# EAGLE design Air Monitor for Home Assistant V1.1 (EAGLE 6.1)
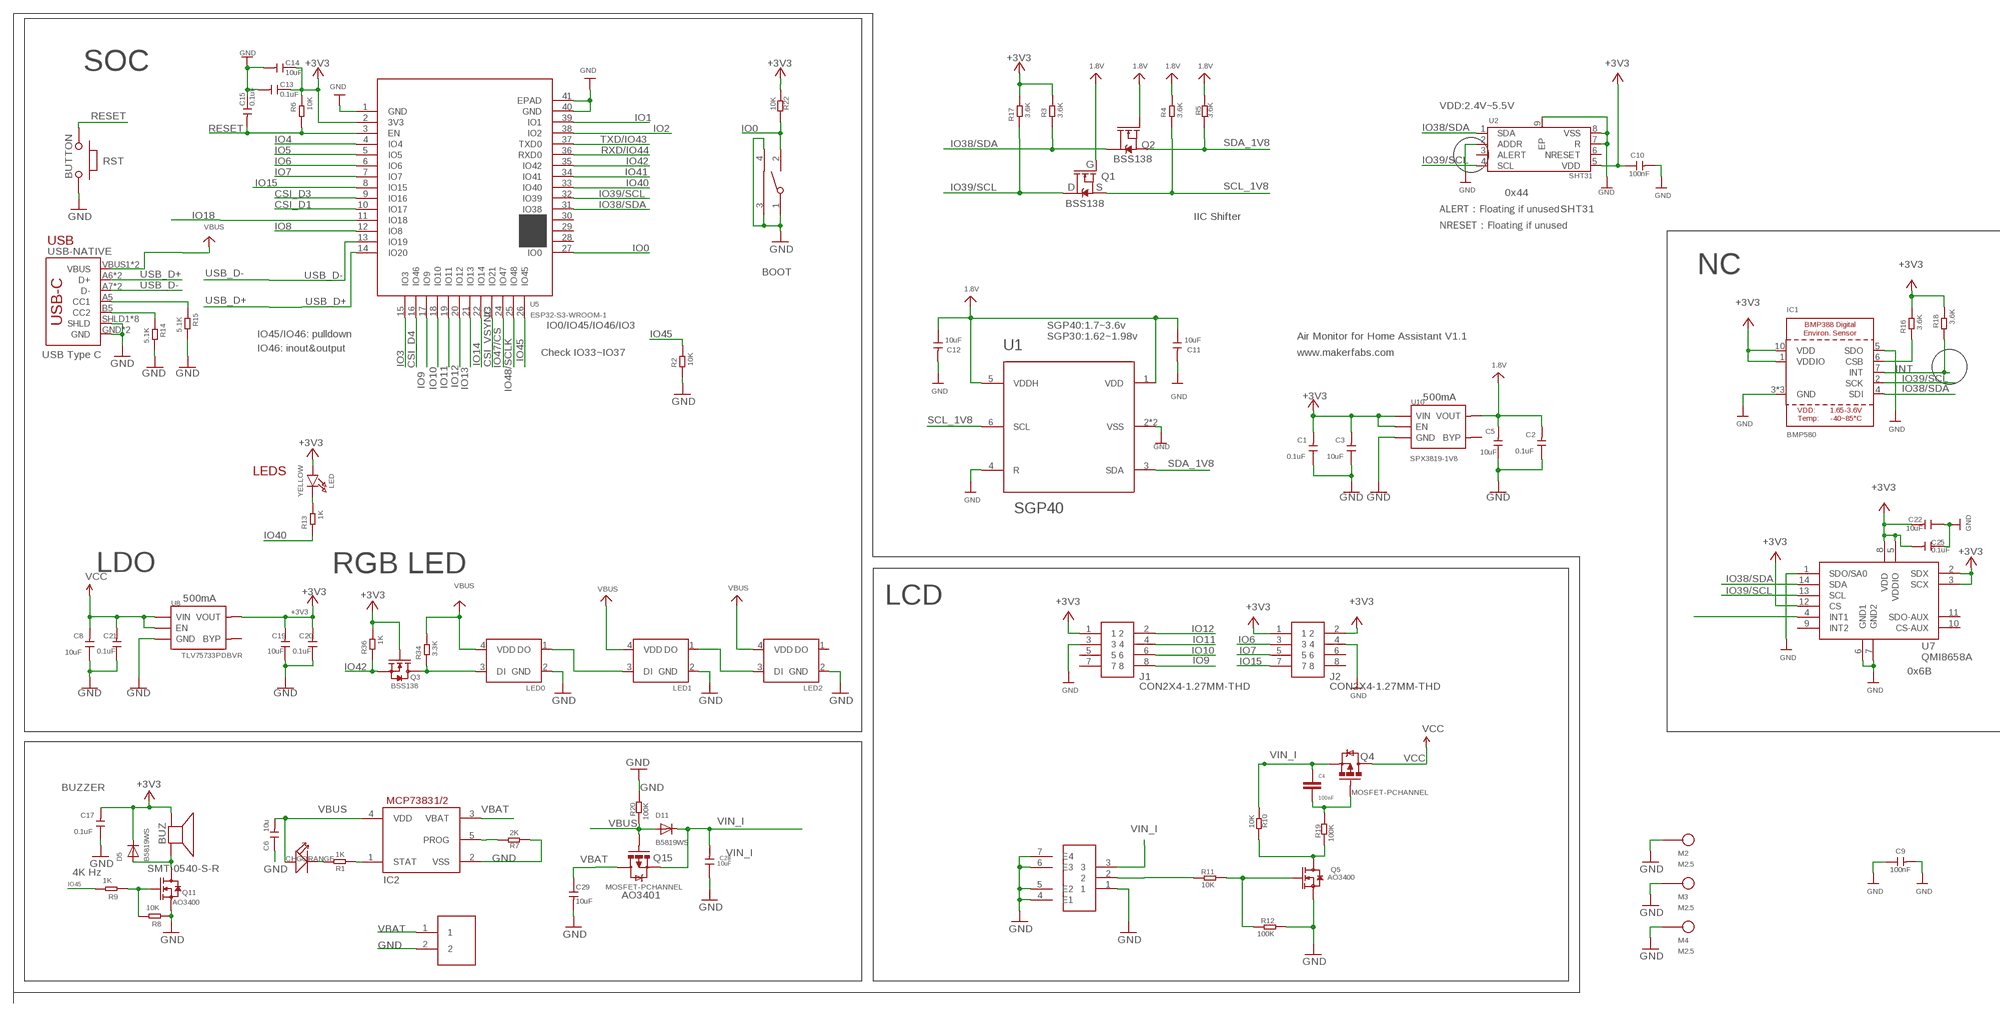
[diagram p0: schematic, sheet 1, part 1 of 2]
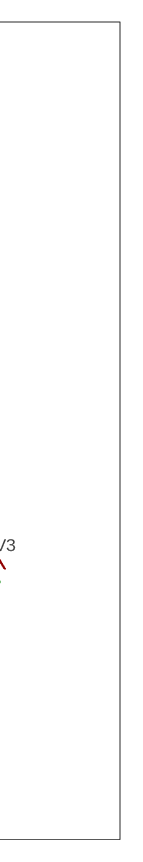
[diagram p1: schematic, sheet 1, part 2 of 2]

## Parts
BAT  PH2.0-2P-90-DIP  [PH2.0-2P-90-DIP]
BOOT  TS24CA  [2*4*3.5MM]
BUZ  SMT-0540-S-R  [SMT-0540-S-R]
C1  0.1uF  DISCRETE_C-0402  [DISCRETE_C0402]
C2  0.1uF  DISCRETE_C-0402  [DISCRETE_C0402]
C3  10uF  DISCRETE_C-0402  [DISCRETE_C0402]
C4  100nF  C0603  [C0603]
C5  10uF  DISCRETE_C-0402  [DISCRETE_C0402]
C6  10u  C-0603  [0603]
C8  10uF  DISCRETE_C-0402  [DISCRETE_C0402]
C9  100nF  C-0603  [0603]
C10  100nF  C-0603  [0603]
C11  10uF  C-0603  [0603]
C12  10uF  C-0603  [0603]
C13  0.1uF  DISCRETE_C-0402  [DISCRETE_C0402]
C14  10uF  DISCRETE_C-0402  [DISCRETE_C0402]
C15  0.1uF  DISCRETE_C-0402  [DISCRETE_C0402]
C17  0.1uF  DISCRETE_C-0402  [DISCRETE_C0402]
C19  10uF  DISCRETE_C-0402  [DISCRETE_C0402]
C20  0.1uF  DISCRETE_C-0402  [DISCRETE_C0402]
C21  0.1uF  DISCRETE_C-0402  [DISCRETE_C0402]
C22  10uF  DISCRETE_C-0402  [DISCRETE_C0402]
C25  0.1uF  DISCRETE_C-0402  [DISCRETE_C0402]
C28  10uF  C-0603  [0603]
C29  10uF  C-0603  [0603]
CHG  ORANGE  007-LED0603  [D0603]
D5  B5819WS  DIODESOD-323F  [SOD-323F]
D11  B5819WS  DIODESOD-323F  [SOD-323F]
IC1  BMP580  BMP388  [BMP388]
IC2  MCP73831/OT  [SOT23-5L]
J1  CON2X4-1.27MM-THD  [CON2X4-1.27MM-THD]
J2  CON2X4-1.27MM-THD  [CON2X4-1.27MM-THD]
LED  YELLOW  LED0805_NOOUTLINE  [CHIPLED_0805_NOOUTLINE]
LED0  WS2812B-2020  [WS2812B-2020]
LED1  WS2812B-2020  [WS2812B-2020]
LED2  WS2812B-2020  [WS2812B-2020]
M2  M2.5  [M2.5]
M3  M2.5  [M2.5]
M4  M2.5  [M2.5]
Q1  BSS138  MOSFET-NCH-BSS138  [SOT23-3]
Q2  BSS138  MOSFET-NCH-BSS138  [SOT23-3]
Q3  BSS138  MOSFET-N'SOT23'  [SOT23]
Q4  MOSFET-PCHANNEL  [SOT23-3]
Q5  AO3400  MOSFET-N'SOT23'  [SOT23]
Q11  AO3400  MOSFET-N'SOT23'  [SOT23]
Q15  MOSFET-PCHANNEL  [SOT23-3]
R1  1K  DISCRETE_R-0402  [DISCRETE_R0402]
R2  10K  DISCRETE_R-0402  [DISCRETE_R0402]
R3  3.6K  DISCRETE_R-0402  [DISCRETE_R0402]
R4  3.6K  DISCRETE_R-0402  [DISCRETE_R0402]
R5  3.6K  DISCRETE_R-0402  [DISCRETE_R0402]
R6  10K  DISCRETE_R-0402  [DISCRETE_R0402]
R7  2K  DISCRETE_R-0402  [DISCRETE_R0402]
R8  10K  DISCRETE_R-0402  [DISCRETE_R0402]
R9  1K  DISCRETE_R-0402  [DISCRETE_R0402]
R10  10K  DISCRETE_R-0402  [DISCRETE_R0402]
R11  10K  DISCRETE_R-0402  [DISCRETE_R0402]
R12  100K  DISCRETE_R-0402  [DISCRETE_R0402]
R13  1K  DISCRETE_R-0402  [DISCRETE_R0402]
R14  5.1K  DISCRETE_R-0402  [DISCRETE_R0402]
R15  5.1K  DISCRETE_R-0402  [DISCRETE_R0402]
R16  3.6K  DISCRETE_R-0402  [DISCRETE_R0402]
R17  3.6K  DISCRETE_R-0402  [DISCRETE_R0402]
R18  3.6K  DISCRETE_R-0402  [DISCRETE_R0402]
R19  100K  DISCRETE_R-0402  [DISCRETE_R0402]
R20  100K  DISCRETE_R-0402  [DISCRETE_R0402]
R22  10K  DISCRETE_R-0402  [DISCRETE_R0402]
R34  3.3K  DISCRETE_R-0402  [DISCRETE_R0402]
R36  1K  DISCRETE_R-0402  [DISCRETE_R0402]
RST  BUTTON  PB157  [157SW]
SW1  SWITCH02B  [SWITCH02B]
U1  SGP40  SGP30  [SGP30]
U2  SHT31  [DFN-8(3X3)_EP]
U5  ESP32-S3-WROOM-1  [ESP32-S3-WROOM-1]
U7  QMI8658A  [LGA14-50P-300L250W86H]
U8  TLV75733PDBVR  SPX3819  [SOT23-5]
U10  SPX3819-1V8  SPX3819  [SOT23-5]
USB-NATIVE  USB_C5  [USB-C-16P-5]

## Nets
1.8V: C2.2 C5.2 C11.1 C12.1 Q1.1(G) Q2.1(G) R4.2 R5.2 U1.1(VDD) U1.5(VDDH) U10.5(VOUT)
+3V3: BUZ.+(-) C1.2 C3.2 C10.1 C13.1 C14.1 C17.2 C19.2 C20.2 C22.2 C25.2 D5.C IC1.1(VDDIO) IC1.10(VDD) J1.1 J2.1 J2.2 LED.A Q3.1(G) R3.2 R6.2 R16.2 R17.2 R18.2 R22.1 R36.2 U2.5(VDD) U5.2(3V3) U7.2(SDX) U7.3(SCX) U7.5(VDDIO) U7.8(VDD) U7.12(CS) U8.5(VOUT) U10.1(VIN) U10.3(EN)
CSI_D1: U5.10(IO17)
CSI_D3: U5.9(IO16)
CSI_D4: U5.16(IO46)
CSI_VSYNC: U5.23(IO21)
GND: BAT.2 BOOT.1 BOOT.3 BOOT.4 C1.1 C2.1 C3.1 C5.1 C6.1 C8.1 C9.1 C9.2 C10.2 C11.2 C12.2 C13.2 C14.2 C15.1 C17.1 C19.1 C20.1 C21.1 C22.1 C25.1 C28.1 C29.2 IC1.3(GND) IC1.5(SDO) IC1.8(GND) IC1.9(GND) IC2.2(VSS) J1.3 J2.4 LED0.2(GND) LED1.2(GND) LED2.2(GND) M2.1 M3.1 M4.1 Q5.2(S) Q11.2(S) R2.1 R7.1 R8.1 R12.2 R14.2 R15.2 R20.2 RST.1 SW1.1 SW1.4(E1) SW1.5(E2) SW1.6(E3) SW1.7(E4) U1.2(VSS) U1.4(R) U1.P$7(VSS) U2.2(ADDR) U2.7(R) U2.8(VSS) U2.9(EP) U5.1(GND) U5.40(GND) U5.41(EPAD) U7.1(SDO/SA0) U7.6(GND1) U7.7(GND2) U8.2(GND) U10.2(GND) USB-NATIVE.GND USB-NATIVE.GND2(GND) USB-NATIVE.SHLD1(SHLD) USB-NATIVE.SHLD2(SHLD) USB-NATIVE.SHLD3(SHLD) USB-NATIVE.SHLD4(SHLD) USB-NATIVE.SHLD5(SHLD) USB-NATIVE.SHLD6(SHLD) USB-NATIVE.SHLD7(SHLD) USB-NATIVE.SHLD8(SHLD)
INT: IC1.7(INT) R18.1
IO0: BOOT.2 R22.2 U5.27(IO0)
IO1: U5.39(IO1)
IO2: U5.38(IO2)
IO3: U5.15(IO3)
IO4: U5.4(IO4)
IO5: U5.5(IO5)
IO6: J2.3 U5.6(IO6)
IO7: J2.5 U5.7(IO7)
IO8: U5.12(IO8)
IO9: J1.8 U5.17(IO9)
IO10: J1.6 U5.18(IO10)
IO11: J1.4 U5.19(IO11)
IO12: J1.2 U5.20(IO12)
IO13: U5.21(IO13)
IO14: U5.22(IO14)
IO15: J2.7 U5.8(IO15)
IO18: U5.11(IO18)
IO38/SDA: IC1.4(SDI) Q2.3(D) R3.1 U2.1(SDA) U5.31(IO38) U7.14(SDA)
IO39/SCL: IC1.2(SCK) Q1.3(D) R17.1 U2.4(SCL) U5.32(IO39) U7.13(SCL)
IO40: R13.1 U5.33(IO40)
IO41: U5.34(IO41)
IO42: Q3.2(S) R36.1 U5.35(IO42)
IO45: R2.2 R9.2 U5.26(IO45)
IO47/CS: U5.24(IO47)
IO48/SCLK: U5.25(IO48)
M-1: BUZ.-(+) D5.A Q11.3(D)
N$1: IC1.6(CSB) R16.1
N$2: U7.4(INT1)
N$3: CHG.- R1.2
N$4: Q5.3(D) R10.2 R19.1
N$5: LED1.1(DO) LED2.3(DI)
N$6: LED0.1(DO) LED1.3(DI)
N$7: R11.1 SW1.2
N$13: C4.2 Q4.1(G) R19.2
N$14: Q5.1(G) R11.2 R12.1
N$18: LED.C R13.2
N$20: LED0.3(DI) Q3.3(D) R34.1
N$25: Q11.1(G) R8.2 R9.1
N$26: IC2.1(STAT) R1.1
N$31: IC2.5(PROG) R7.2
N$33: R15.1 USB-NATIVE.A5(CC1)
N$34: R14.1 USB-NATIVE.B5(CC2)
RESET: C15.2 R6.1 RST.2 U5.3(EN)
RXD/IO44: U5.36(RXD0)
SCL_1V8: Q1.2(S) R4.1 U1.6(SCL)
SDA_1V8: Q2.2(S) R5.1 U1.3(SDA)
TXD/IO43: U5.37(TXD0)
USB_D+: U5.14(IO20) USB-NATIVE.A6(D+) USB-NATIVE.B6(D+)
USB_D-: U5.13(IO19) USB-NATIVE.A7(D-) USB-NATIVE.B7(D-)
VBAT: BAT.1 C29.1 IC2.3(VBAT) Q15.3(D)
VBUS: C6.2 CHG.+ D11.A IC2.4(VDD) LED0.4(VDD) LED1.4(VDD) LED2.4(VDD) Q15.1(G) R20.1 R34.2 USB-NATIVE.VBUS1(VBUS) USB-NATIVE.VBUS2(VBUS)
VCC: C8.2 C21.2 Q4.3(D) U8.1(VIN) U8.3(EN)
VIN_I: C4.1 C28.2 D11.C Q4.2(S) Q15.2(S) R10.1 SW1.3
Unconnected: J1.5 J1.7 J2.6 J2.8 LED2.1(DO) U2.3(ALERT) U2.6(NRESET) U5.28(IO35) U5.29(IO36) U5.30(IO37) U7.9(INT2) U7.10(CS-AUX) U7.11(SDO-AUX) U8.4(BYP) U10.4(BYP)

## Notes on the sheet
- SOC
- VDD:2.4V~5.5V
- G
- D | S
- 0x44
- ALERT：Floating if unused | SHT31
- IIC Shifter
- NRESET：Floating if unused
- USB
- BOOT | NC
- IO0/IO45/IO46/IO3 | SGP40:1.7~3.6v
- IO45/IO46: pulldown | SGP30:1.62~1.98v | Air Monitor for Home Assistant V1.1
- IO46: inout&output
- USB Type C | Check IO33~IO37 | www.makerfabs.com
- 500mA
- LEDS
- LDO | RGB LED
- 500mA
- LCD
- 0x6B
- BUZZER
- 4K Hz
- AO3401

## Library data of the parts
BAT = Connector:PH2.0-2P-90-DIP
BOOT = sale:TS24CA
BUZ = adafruit:SMT-0540-S-R: SMT-0549-S-R Small surface-mount magnetic buzzer
C1-C3 C5 C8 C13-C15 C17 C19-C22 C25 = A9G:DISCRETE_C*: Ceramic Capacitors
C4 = Makerfabs-Peter:C0603
C6 C9-C12 C28 C29 = Discrete:C*: Ceramic Capacitors
CHG = Discrete:007-LED*
D5 D11 = adafruit2:DIODE: Diode SMADIODE - SMA Surface Mount Package 20V 1A Schottky Diode Digikey: 641-1014-6-ND DO-1N4148 - Through Hole Small Current Diode SOD-123 20V 1 A (.5mV Vf) Schottky Diode - Digikey: MBRX120TPMSCT-ND SOD-323 10V 570mA (.38mV Vf, 3ns) Schottky Diode - Digikey: ZLLS410CT-ND SOD-523 30V 30mA Schottky Diode (RB751S-40TE61) - Digikey: RB751S-40TE61CT-ND SOT23-R/W - SOT23 Package (R = Solder Paste/Reflow Ovens, W = Hand-Soldering) BAT54Film 40V 300mA - Digikey: 497-7162-1-ND
IC1 = adafruit_sensor:BMP388
IC2 = adafruit:MCP73831: MCP73831/2 Miniature Single-Cell, Fully Integrated Li-Ion, Li-Polymer Charge Management Controllers. Nice and small simple lipoly charge controller, with adjustable current and status output (LED) http://www.ladyada.net/library/pcb/eaglelibrary.html
J1 J2 = user:CON2X4-1.27MM-THD
LED = microbuilder:LED: LED 0603 - 0603 Surface Mount Package 2mA: Green LED - Low Power (3.9mcd, 2ma, 1.7Vf) - Digikey: 475-2709-2-ND Orange LED - Low Power (9.8mcd, 2ma, 1.8Vf) - Digikey: 475-1194-2-ND Red LED - Low Power (5mcd, 2ma, 1.8Vf) - Digikey: 475-1195-2-ND Yellow LED - Low Power (7mcd, 2ma, 1.8Vf) - Digikey: 475-1196-2-ND 5mA: Blue LED - Low Power (17mcd, 5ma, 2.9Vf) - Digikey: LNJ937W8CRACT-ND 0805 - 0805 Surface Mount Package 2mA: Red LED (8.8mcd, 2mA, 1.8Vf, Clear) - Low Power [Digikey: 475-2510-1-ND] Green LED (5mcd, 2mA, 1.8Vf, Clear) - Low Power [Digikey: 475-2730-1-ND] Yellow LED (11.3mcd, 2mA, 1.8Vf, Clear) - Low Power [Digikey: 475-2555-1-ND] 20mA: Red LED (104mcd, 20mA, Diffused) - LS R976 [Digikey: 475-1278-6-ND] Red LED (12mcd, 20mA, 2.0Vf, Clear) - APT2012EC [Digikey: 754-1128-1-ND] Green LED (15mcd, 20mA, 2.2Vf, Clear) - APT2012GC [Digikey: 754-1131-1-ND] Orange LED (160mcd, 20mA, 2.1Vf, Clear) - APT2012SECK [Digikey: 754-1130-1-ND] 1206 - 1206 Surface Mount Package Green LED (26mcd, 20mA, Diffused) - LG N971 [Digikey: 475-1407-6-ND] Red LED (15mcd, 20mA, Diffused) - LH N974 [Digikey: 475-1416-6-ND] Cree - Cree High-Power Surface Mount LEDs XPEBWT-L1-0000-00D50 - White 111lm 350mA 2.9Vf 6200K 110° XTEAWT-00-0000-00000LEE3 - White 114lm 350mA 2.85Vf 5000K 115° Everlight - Everlight 45-21 Series Surface Mount LEDs 45-21/QK2C-B2832AC2CB2/2T - Warm White 2000mcd 20mA 3.25Vf 3050K 120° 45-21/LK2C-B38452C4CB2/2T - Nuetral White 2000mcd 20mA 3.25Vf 4150K 120° 45-21/LK2C-B50634C6CB2/2T - Cold White 2200mcd 20mA 3.25Vf 5650K 120° PLCC2 Reverse Mount LS T77K-J1L2-1-0-2-R18-Z - Red 11.25mcd 2mA 1.8Vf 630nm 120° LO T77K-L1M2-24-Z - Orange 19.6mcd 2mA 1.8Vf 606nm 120° LY T77K-K2M1-26-Z - Yellow 15.7mcd 2mA 1.8Vf 587nm 120°
LED0 LED1 LED2 = user:WS2812B-2020
M2-M4 = sale:M2.5
Q1 Q2 = SparkFun-DiscreteSemi:MOSFET-NCH: N-channel MOSFETs Voltage controlled devices that allow control of high current outputs. SparkFun Products: SparkFun OpenScale <https://www.sparkfun.com/products/13261> SparkFun Digital Sandbox <https://www.sparkfun.com/products/12651> SparkFun Monster Moto Shield <https://www.sparkfun.com/products/10182> SparkFun MOSFET Power Controller <https://www.sparkfun.com/products/11214>; PROD_ID: TRANS-00830; VALUE: 220mA/50V/3.5Ω
Q3 Q5 Q11 = Discrete:MOSFET-N: IRLL014: http://www.vishay.com/docs/91319/sihll014.pdf
Q4 Q15 = User-Submitted:MOSFET-PCHANNEL: Generic PMOSFET IRLML2244 - TRANS-11153 (SOT-23 -20V -4.3A) (1.Gate 2.Source 3.Drain) FQP27P06 - COM-10349 <http://www.sparkfun.com/products/10349> (TO-220 -60V -27A) (1.Gate 2.Source 3.Drain); PROD_ID: TRANS-08285
R1-R20 R22 R34 R36 = A9G:DISCRETE_R*
RST = MySMD:PB157
SW1 = user:SWITCH02B
U1 = SGP30 Rev D:SGP30: Sensirion SGP30 multi-pixel gas sensor
U2 = SGP30 Rev D:SHT31
U5 = self:ESP32-S3-WROOM-1
U7 = user:QMI8658A
U8 U10 = IC:SPX3819
USB-NATIVE = USBC:USB_C: USB Type C 16Pin Connector Super Speed pins not available on the 16-pin purely SMD connector so this part is best for USB 2.0 implementations. D1 and D2 are tied together enabling D+/- no matter which way the cable is plugged into the connector. The two channel configuration pins (CC1/2) are exposed. These are normally connected to ground via 5.1k resistors but can be reconfigured for high current/high power applications.

## Net classes
0 default: width 0.203 mm, drill 0.305 mm, clearance 0.152 mm
2 gnd: width 0.305 mm, drill 0.559 mm, clearance 0.254 mm
3 usbvcc: width 0.508 mm, drill 0.61 mm, clearance 0.254 mm
4 USBpair: width 0.254 mm, drill 0.406 mm, clearance 0.406 mm

## Board
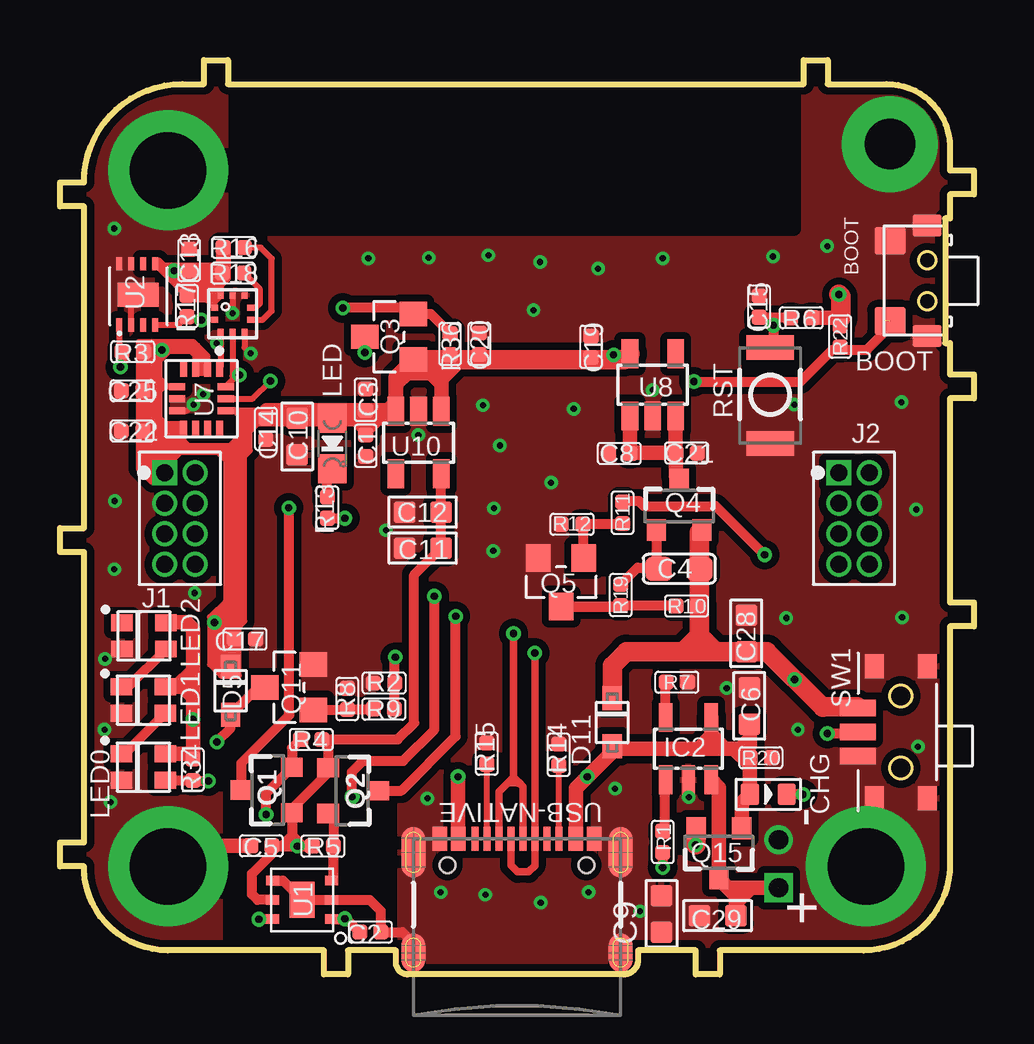
[diagram p2: board, top side]
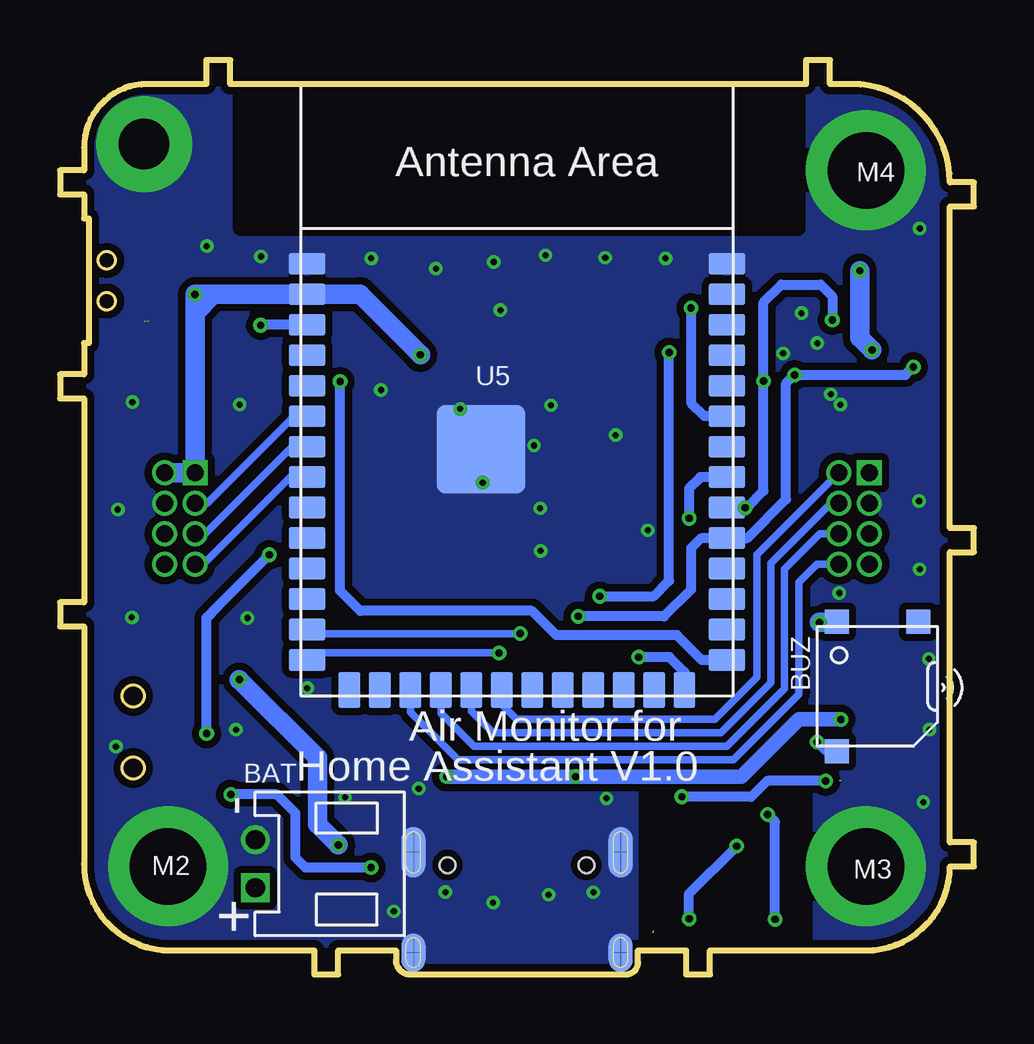
[diagram p3: board, bottom side, seen from below]

Size 38.1 x 38.1 mm. Coordinates in mm from the lower left corner, seen from the top.
Outline: 11,1 4.5,1 arc-90 1,4.5 0,4.5 0,5.5 1,5.5 1,17.6 0,17.6 0,18.6 1,18.6 1,32 0,32 0,33 1,33 arc-90 5.1,37.1 6,37.1 6,38.1 7,38.1 7,37.1 31,37.1 31,38.1 32,38.1 32,37.1 34.46,37.1 arc-90 37.1,34.46 37.1,33.5 38.1,33.5 38.1,32.5 37.1,32.5 37.1,31.5 36.9,31.5 36.9,26.3 37.1,26.3 37.1,25 38.1,25 38.1,24 37.1,24 37.1,15.5 38.1,15.5 38.1,14.5 37.1,14.5 37.1,4.61 arc-90 33.49,1 27.5,1 27.5,0 26.5,0 26.5,1 24.1,1 24.1,0.6 arc-90 23.5,0 14.5,0 arc-90 14,0.5 14,1 12,1 12,0 11,0 11,1
Copper layers (1*16): Top 0.035mm / dielectric 1.5mm / Bottom 0.035mm
Design rules: minimum track width 6mil, minimum drill 8mil, track to track 6mil, track to pad 6mil, pad to pad 6mil, via to via 6mil, smd to smd 0mil, copper to edge 10mil, drill to drill 10mil, minimum pad ring 4mil, minimum via ring 6mil, stop-mask expansion 2mil, vias tented up to drill 30mil, thermal gap 0mil
tRestrict: area 7.3,31.1 to 30.6,37.6; area 7.1,1.3 to 13.8,9.4
bRestrict: area 7.3,31.1 to 30.6,37.6; area 7,1.4 to 13.7,9.5

### Footprints (pad centres in the part's own frame; a part is rotated, then mirrored left to right if it is on the bottom)
PH2.0-2P-90-DIP = drill 0.8 square: 1 0,1 | drill 0.8: 2 0,-1
2*4*3.5MM = smd 1.15 x 1.3: 1 -1.675,0; 2 1.675,0 | smd 0.9 x 1.2: 3 2.3,1.55; 4 -2.3,1.55
SMT-0540-S-R = smd 1 x 1: + 1.7,-2.7; - 1.7,2.7; M -1.7,-2.7
DISCRETE_C0402 = smd 0.635 x 0.635: 1 -0.445,0; 2 0.445,0
C0603 = smd 1.1 x 1: 1 -0.85,0; 2 0.85,0
0603 = smd 0.889 x 0.889: 1 -0.762,0; 2 0.762,0
D0603 = smd 0.762 x 0.889: + -0.762,0; - 0.762,0
SOD-323F = smd 1 x 0.8: A -1,0; C 1,0
BMP388 = smd 0.25 x 0.275: 1 0.25,0.75; 2 -0.25,0.75; 6 -0.25,-0.75; 7 0.25,-0.75 | smd 0.275 x 0.25: 3 -0.762,0.5; 4 -0.762,0; 5 -0.762,-0.5; 8 0.762,-0.5; 9 0.762,0; 10 0.762,0.5
SOT23-5L = smd 0.55 x 1.2: 1 -0.95,-1.3; 2 0,-1.3; 3 0.95,-1.3; 4 0.95,1.3; 5 -0.95,1.3
CON2X4-1.27MM-THD = drill 0.7 pad 0.95 square: 1 -1.905,-0.635 | drill 0.7 pad 0.95: 2 -1.905,0.635; 3 -0.635,-0.635; 4 -0.635,0.635; 5 0.635,-0.635; 6 0.635,0.635; 7 1.905,-0.635; 8 1.905,0.635
CHIPLED_0805_NOOUTLINE = smd 1.2 x 1.2: A 0,-1.05; C 0,1.05
WS2812B-2020 = smd 0.9 x 0.7: 1 -0.915,0.55; 2 -0.915,-0.55; 3 0.915,-0.55; 4 0.915,0.55
M2.5 = drill 3.2 pad 5: 1 0,0
SOT23-3 = smd 0.8 x 0.9: 1 -0.95,-1; 2 0.95,-1; 3 0,1.1
SOT23 = smd 1.016 x 1.143: 1 -0.95,-1.016; 2 0.95,-1.016; 3 0,1.016
DISCRETE_R0402 = smd 0.635 x 0.635: 1 -0.445,0; 2 0.445,0
157SW = smd 1.016 x 1.981: 1 0,0; 2 4,0
SWITCH02B = smd 0.7 x 1.5: 1 -1,1.45; 2 0,1.45; 3 1,1.45 | smd 1 x 0.8: 4 -2.75,0.75; 5 -2.75,-1.45; 6 2.75,0.75; 7 2.75,-1.45
SGP30 = smd 0.55 x 0.4: 1 -1.225,0.8; 2 -1.225,0; 3 -1.225,-0.8; 4 1.225,-0.8; 5 1.225,0; 6 1.225,0.8 | smd 1.05 x 1.5: P$7 0,0
DFN-8(3X3)_EP = smd 0.55 x 0.25: 1 0,0; 2 0,-0.5; 3 0,-1; 4 0,-1.5; 5 2.55,-1.5; 6 2.55,-1; 7 2.55,-0.5; 8 2.55,0 | smd 1 x 1.7: 9 1.25,-0.785
ESP32-S3-WROOM-1 = smd 1.5 x 0.9: 1 -8.75,5.26; 2 -8.75,3.99; 3 -8.75,2.72; 4 -8.75,1.45; 5 -8.75,0.18; 6 -8.75,-1.09; 7 -8.75,-2.36; 8 -8.75,-3.63; 9 -8.75,-4.9; 10 -8.75,-6.17; 11 -8.75,-7.44; 12 -8.75,-8.71; 13 -8.75,-9.98; 14 -8.75,-11.25; 27 8.75,-11.25; 28 8.75,-9.98; 29 8.75,-8.71; 30 8.75,-7.44; 31 8.75,-6.17; 32 8.75,-4.9; 33 8.75,-3.63; 34 8.75,-2.36; 35 8.75,-1.09; 36 8.75,0.18; 37 8.75,1.45; 38 8.75,2.72; 39 8.75,3.99; 40 8.75,5.26 | smd 0.9 x 1.5: 15 -6.985,-12.5; 16 -5.715,-12.5; 17 -4.445,-12.5; 18 -3.175,-12.5; 19 -1.905,-12.5; 20 -0.635,-12.5; 21 0.635,-12.5; 22 1.905,-12.5; 23 3.175,-12.5; 24 4.445,-12.5; 25 5.715,-12.5; 26 6.985,-12.5 | smd 3.7 x 3.7: 41 -1.5,-2.46
LGA14-50P-300L250W86H = smd 0.675 x 0.28: 1 -1.262,0.75; 2 -1.262,0.25; 3 -1.262,-0.25; 4 -1.262,-0.75; 8 1.262,-0.75; 9 1.262,-0.25; 10 1.262,0.25; 11 1.262,0.75 | smd 0.28 x 0.675: 5 -0.5,-1.012; 6 0,-1.012; 7 0.5,-1.012; 12 0.5,1.012; 13 0,1.012; 14 -0.5,1.012
SOT23-5 = smd 0.69 x 1.2: 1 -0.95,-1.3; 2 0,-1.3; 3 0.95,-1.3; 4 0.95,1.3; 5 -0.95,1.3
USB-C-16P-5 = smd 0.3 x 1: A5 -1.25,-0.34; A6 -0.25,-0.34; A7 0.25,-0.34; A8 1.25,-0.34; B5 1.75,-0.34; B6 0.75,-0.34; B7 -0.75,-0.34; B8 -1.75,-0.34 | smd 0.6 x 1: GND -3.225,-0.34; GND2 3.225,-0.34; VBUS1 -2.45,-0.34; VBUS2 2.45,-0.34 | smd 1 x 2.1: SHLD1 -4.32,-0.915; SHLD2 4.32,-0.915 | smd 1 x 2.1 bottom: SHLD3 -4.32,-0.915; SHLD4 4.32,-0.915 | smd 1 x 1.6: SHLD5 -4.32,-5.095; SHLD8 4.32,-5.095 | smd 1 x 1.6 bottom: SHLD6 -4.32,-5.095; SHLD7 4.32,-5.095 | hole 0.65: -2.89,-1.445; 2.89,-1.445

### Placement (x,y rotation side)
BAT  29.96,4.61 180 bottom
BOOT  34.6,28.9 270 top
BUZ  4.02,12 180 bottom
C1  12.74,22.03 90 top
C2  12.94,1.76 180 top
C3  12.74,23.94 270 top
C4  25.82,16.9 180 top
C5  8.39,5.36 0 top
C6  28.74,11.19 270 top
C8  23.32,21.71 0 top
C9  25.08,2.52 90 top
C10  9.89,22.41 270 top
C11  15.12,17.76 180 top
C12  15.12,19.26 180 top
C13  5.38,29.77 90 top
C14  8.59,22.73 270 top
C15  29.14,27.83 270 top
C17  7.71,13.97 180 top
C19  22.13,26.15 270 top
C20  17.48,26.27 270 top
C21  26.12,21.73 180 top
C22  3.01,22.64 0 top
C25  3.01,24.32 0 top
C28  28.61,14.21 270 top
C29  27.42,2.45 180 top
CHG  29.52,7.5 0 top
D5  7.11,11.82 90 top
D11  23.02,10.5 90 top
IC1  7.2,27.52 90 top
IC2  26.2,9.41 0 top
J1  5,19 270 top
J2  33.1,19 270 top
LED  11.36,22.12 180 top
LED0  3.48,8.64 0 top
LED1  3.48,11.43 0 top
LED2  3.5,14.11 0 top
M2  33.6,4.5 0 bottom
M3  4.5,4.5 0 bottom
M4  4.5,33.5 0 bottom
Q1  8.67,7.68 90 top
Q2  12.18,7.65 270 top
Q3  13.72,26.57 90 top
Q4  25.82,19.52 0 top
Q5  20.89,16.34 180 top
Q11  9.55,11.96 90 top
Q15  27.47,5.09 180 top
R1  25.13,5.52 270 top
R2  13.51,12.14 0 top
R3  3.03,25.94 0 top
R4  10.47,9.79 0 top
R5  10.96,5.34 180 top
R6  30.9,27.36 0 top
R7  25.71,12.18 180 top
R8  11.98,11.48 270 top
R9  13.5,11.05 0 top
R10  26.12,15.35 180 top
R11  23.45,19.24 270 top
R12  21.35,18.75 180 top
R13  11.15,19.45 90 top
R14  20.79,9.15 90 top
R15  17.79,9.2 90 top
R16  7.25,30.29 180 top
R17  5.29,27.85 90 top
R18  7.22,29.22 180 top
R19  23.38,15.81 90 top
R20  29.22,9.03 0 top
R22  32.52,26.58 270 top
R34  5.54,8.53 90 top
R36  16.26,26.27 270 top
RST  29.6,22.13 90 top
SW1  34.7,10.1 90 top
U1  10.09,3.11 180 top
U2  2.47,27.06 90 top
U5  19.05,24.35 0 bottom
U7  5.9,23.99 270 top
U8  24.71,24.57 0 top
U10  14.95,22.16 180 top
USB-NATIVE  19.05,6 0 top

### Tracks (layer width: path | path; a pad name or v marks a point on that pad's centre or on a via)
1.8V  (via drill 0.3)
  Top 0.406: U1.5 8.24,3.11 8.01,3.34 8.01,4.2 8.84,5.03 C5.2 8.85,5.34 9.69,5.34 | 10.14,5.34 v9.89,5.34 9.69,5.34 | 10.14,5.34 R5.2 | 9.69,5.8 9.69,6.71 Q1.1 9.67,6.9 11.18,8.41 Q2.1 11.18,9.53 R4.2 14.08,9.79 14.77,10.47 14.77,16.65 C11.1 C12.1 15.88,20.85 U10.5 | 9.69,5.8 9.69,5.34 | U1.1 11.86,2.31 v11.87,2.32 11.9,2.35 C2.2 | 8.95,5.37 9.26,5.37 9.69,5.8 | 9.69,5.8 10.14,5.34
  Bottom 0.406: v11.87,2.32 11.87,3.36 v9.89,5.34
+3V3  (via drill 0.3)  (1 unrouted)
  Top 0.254: C13.1 4.26,29.32 U2.5 | R18.2 6.7,29.14 IC1.10 6.45,28.03 IC1.1 | U7.5 3.62,24.49 C25.2 | U7.2 U7.3 5.65,25.79 5.47,25.97 3.5,25.97 R3.2 | C22.2 5.07,22.64 U7.8 | 7.29,23.49 U7.12 6.91,23.5 7.3,23.5 | 7.29,23.49 7.33,23.45 | 7.33,23.45 7.58,23.2 7.58,23.1 | 7.58,23.1 7.58,22.34 7.1,21.85 4.12,21.85 3.77,21.5 | C14.1 7.65,23.17 7.58,23.1 | Q3.1 16.06,25.62 R36.2 C20.2 | C19.2 22.25,25.82 v23.08,25.82 23.12,25.87 U8.5 | 4.02,29.75 4.12,29.75 4.33,29.55 6.49,29.55 6.64,29.7 6.64,30.46 6.99,30.46 6.99,28.99 6.69,28.69 IC1.10 6.44,28.03 6.44,27.77 6.11,28.1 5.27,28.1 5.27,28.3 4.1,29.47 4.38,29.47 5.22,28.64 5.22,28.86 4.81,29.27 | 4.81,29.27 5.37,29.27 5.57,29.07 6.51,29.07 6.54,29.04 6.54,28.41 6.26,28.13 6.26,28.18 6.13,28.3 5.67,28.3 5.62,28.36 5.62,28.84 5.67,28.89 6.33,28.89 6.33,28.51 6.26,28.43 5.88,28.43 5.8,28.51 5.8,28.69 6.23,28.69 6.23,28.61 6.18,28.56 5.8,28.56 5.75,28.61 | v6.44,14.66 7.13,13.97 C17.2 7.11,13.82 D5.C | 6.16,25.05 5.7,25.05 5.7,25.46 6.16,25.46 6.16,25.77 5.75,26.17 | 5.75,26.17 5.72,26.2 | 5.72,26.2 3.29,26.2 3.29,21.07 3.85,20.51 4.76,20.51 4.76,21.5 5.04,21.78 6.56,21.78 6.92,21.42 6.92,15.55 6.26,14.89 6.26,12.91 6.71,12.46 7.45,12.46 7.45,14.49 7.68,14.72 7.68,21.6 7.91,21.83 7.91,22.64 8.24,22.97 | 8.26,23 8.24,22.97 | 8.24,22.97 12.25,22.97 12.81,22.41 12.81,22.49 13.32,23 14.21,23 14.21,24.52 14.56,24.88 15.38,24.88 15.73,24.52 16.04,24.52 16.04,24.7 16.8,25.46 16.52,25.46 16.11,25.05 | 8.32,23.35 7.45,23.35 7.3,23.5 | 7.3,23.5 8.37,23.5 8.49,23.63 8.49,23.43 7.73,22.67 7.73,22.95 | 7.73,22.95 7.86,23.07 | 7.73,22.95 7.71,22.92 7.71,21.9 7.5,21.7 7.5,14.72 7.25,14.46 7.25,13.27 6.71,12.73 6.71,12.68 6.46,12.94 6.46,14.84
  Top 0.254: 7.6,21.93 7.6,23.25 7.55,23.3 7.55,22.49 7.07,22.01 5.37,22.01 5.17,22.21 5.17,22.92 4.4,22.92 4.15,23.17 4.15,24.32 4.33,24.5 4.48,24.5 | 5.04,24.5 4.48,24.5 | 4.48,24.5 4.15,24.82 4.15,25.59 4.63,26.07 5.62,26.07 5.93,25.77 5.93,25.41 5.75,25.59 5.75,26.17 | 5.72,26.2 5.57,26.35 3.29,26.35 3.29,26.22 3.72,25.79 | 4.86,22.08 4.99,21.95 6.64,21.95 6.99,21.6 6.99,21.55 | 3.92,25.89 4.12,25.89 v4.25,26.02 | 4.81,29.27 v4.76,29.32 | 7.29,23.49 7.33,23.49 7.33,23.45
  Top 0.406: J1.1 3.77,21.5 3.45,21.82 C22.2 C25.2 3.45,25.92 R3.2 | R16.2 6.78,30.26 R18.2 6.67,29.32 C13.1 5.39,29.32 | C17.2 7.27,21.68 7.1,21.85 | 16.11,25.05 16.09,25.03 14.51,25.03 13.9,24.42 13.9,23.86 13.62,23.58 8.54,23.58 8.32,23.35 | R22.1 32.55,27.05 32.55,27.64
  Top 0.61: R6.2 32.55,27.36 | U10.1 15.9,25.46 R36.2 | Q3.1 14,24.88 U10.3 13.71,23.17 12.84,23.17 | 12.84,23.17 LED.A C10.1 C14.1 | C1.2 C3.2 12.74,23.27 12.84,23.17 | 6.46,14.84 6.46,13.47 6.92,13.01 6.92,15.1 7.17,15.35 7.17,21.5 7.6,21.93 | R17.2 5.29,29.23 C13.1
  Top 0.813: 32.55,27.36 32.55,27.64 32.55,28.25 v32.47,28.33 | U8.5 23.51,25.62 Q3.1 | 3.72,25.79 3.82,25.79 | 3.92,25.89 3.82,25.79 | 3.82,25.79 3.82,22.34 4.02,22.54 4.35,22.54 | 4.83,22.54 4.35,22.54 | 4.35,22.54 3.67,21.85 3.67,21.4 4.15,20.91 4.45,20.91 4.45,21.5 4.35,21.6 4.83,22.08 4.86,22.08
  Bottom 0.254: 32.45,27.59 32.45,26.77 32.47,26.76
  Bottom 0.61: 5.75,14.66 BUZ.+
  Bottom 0.813: v6.44,14.66 5.75,14.66 | J2.2 J2.1 32.47,26.76 v32.47,28.32 v32.47,28.33 v32.46,28.34 U5.2 25.6,28.34 v23.08,25.82 | 31.71,28.33 32.45,27.59 | v4.25,26.02 4.76,26.53 v4.76,29.32
GND  (via drill 0.25, 2.1 pad 4)  (1 unrouted)
  Top 0.254: U2.2 2.97,28.02 U2.9 | 6.7,26.24 6.7,25.29 U7.1 | IC1.9 v7.2,27.56 v7.19,27.55 | IC1.3 6.7,26.24 | U7.7 5.31,23.49 v5.57,23.74 | IC1.5 7.7,26.13 v7.95,25.87 | v6.53,26.3 6.64,26.3 6.7,26.24
  Top 0.406: U1.4 9.29,3.91 U1.P$7 U1.2 12.49,3.11 12.91,3.11 13.37,2.65 13.37,1.84 13.34,1.81 | IC2.2 26.2,7.4 v26.21,7.38 | C2.1 14.27,1.76 14.75,1.28 14.75,0.84 14.71,0.79
  Top 0.61: C5.1 5.36,5.36 M3.1
  other vias: 25.12,29.84 18.34,22.04 31.98,30.34 22.43,29.4 20.02,29.68 15.37,29.86 2.26,16.88 18.06,17.64 20.04,2.99 17.73,3.32 2.26,31.08 2.29,19.73 1.88,13.15 1.86,10.2 2.11,7.18 24.18,2.63 35.11,14.88 30.76,10.2 27.79,11.93 30.28,14.85 35.08,23.84 35.69,19.37 34.6,34.6 21.41,23.56 24.72,24.35 20.48,20.49 13.59,18.51 12.86,29.84 5.97,24.17 14.94,22.47 17.63,23.71 18.09,19.42 19.74,27.68 29.72,29.91 30.61,23.74 5.62,15.89 15.32,7.33 23.14,7.74 15.87,3.42 22.03,3.43 35.77,9.49 17.86,29.96
  pour Bottom (isolate 0.305, rank 6): -5,-5 47,-5 47,47 -5,47
  pour Top (isolate 0.305, rank 6): -4,-4 41,-4 41,41 -4,41
INT
  Top 0.254: IC1.7 8.16,27.77 8.34,27.95 8.34,28.55 R18.1
IO0  (via drill 0.3)  (1 unrouted)
  Top 0.406: 32.6,26.02 32.2,26.02 30.87,24.7 v26.43,24.7 | 32.6,26.02 32.52,26.1 R22.2 | 32.6,26.02 33.65,26.02 34.58,26.96 34.58,27.23 34.59,27.23 BOOT.2 | 34.4,27.24 34.4,27.23
  Bottom 0.406: U5.27 11.35,13.1 12.38,14.13 17.41,14.13 18.42,15.15 25.59,15.15 26.43,15.99 v26.43,24.7
IO6
  Bottom 0.305: U5.6 28.35,23.26 31.97,19.64 J2.3
IO7
  Bottom 0.305: U5.7 28.42,21.99 32.05,18.36 J2.5
IO9
  Bottom 0.305: J1.8 6.55,17.09 7.3,16.34 7.3,11.67 10.02,8.95 21.5,8.95 23.48,10.93 23.48,11.83 U5.17
IO10
  Bottom 0.305: J1.6 6.42,18.36 7.91,16.88 7.91,11.9 10.3,9.51 20.84,9.51 22.21,10.88 22.21,11.83 U5.18
IO11
  Bottom 0.305: J1.4 5.96,19.64 8.47,17.13 8.47,12.15 10.55,10.07 20.05,10.07 20.94,10.96 20.94,11.83 U5.19
IO12
  Bottom 0.305: J1.2 9.05,17.49 9.05,12.38 10.8,10.63 19.06,10.63 19.68,11.25 U5.20
IO15
  Bottom 0.305: U5.8 28.5,20.72 32.12,17.09 J2.7
IO38/SDA  (via drill 0.3)
  Top 0.254: U2.1 2.47,26.06 R3.1 | IC1.4 7.2,24.93 | 7.2,24.93 7.2,24.77 U7.14 | v7.48,24.98 7.25,24.98 7.2,24.93
  Top 0.406: Q2.3 14.23,7.66 16.49,9.91 v16.49,14.92 | R3.1 2.59,25.37 v2.52,25.31
  Bottom 0.406: v16.49,14.92 12.91,14.92 11.79,16.04 11.79,17.76 11.39,18.17 U5.31 9.45,18.18 7.83,19.8 7.83,24.62 v7.48,24.98 2.85,24.98 v2.52,25.31
IO39/SCL  (via drill 0.3)
  Top 0.254: U2.4 4.95,27.06 R17.1 5.43,27.27 v5.9,27.27 IC1.2 | U7.13 8.04,23.99 v8.77,24.72
  Top 0.406: Q1.3 7.57,8.82 9.56,10.8 9.56,19.41 v9.53,19.44
  Bottom 0.305: v9.53,19.44 U5.32
  Bottom 0.406: U5.32 9.47,19.45 8.77,20.15 v8.77,24.72 8.77,28 8.04,28.74 6.38,28.74 5.9,28.25 v5.9,27.27
IO40  (via drill 0.3)
  Top 0.406: R13.1 v11.87,19.01
  Bottom 0.406: U5.33 11.4,20.72 11.87,20.25 v11.87,19.01
IO42  (via drill 0.3)
  Top 0.254: Q3.2
  Top 0.406: v11.79,27.77 14.48,27.77 Q3.2 15.45,27.52 R36.1
  Bottom 0.406: U5.35 11.25,23.26 11.77,23.78 11.77,27.75 v11.79,27.77
IO45  (via drill 0.3)
  Top 0.406: R9.2 R2.2 13.96,13.19 v13.98,13.22
  Bottom 0.406: U5.26 12.06,12.6 12.68,13.22 v13.98,13.22
M-1  (via drill 0.3)
  Top 0.406: v6.54,9.69 7.11,10.26 D5.A 8.25,11.96 Q11.3
  Bottom 0.406: BUZ.- 6.15,9.3 v6.54,9.69
N$1
  Top 0.254: IC1.6 8.45,27.27 8.82,27.64 8.82,29.83 8.37,30.29 R16.1
N$3  (via drill 0.3)
  Top 0.406: v30.97,7.5 CHG.- | R1.2 | R1.2 25.11,5.05 25.11,4.43 v25.13,4.45
  Bottom 0.406: v30.97,7.5 29.07,7.5 28.28,6.71 28.28,4.86 28.08,4.66 27.87,4.45 v25.13,4.45
N$4
  Top 0.406: 23.35,15.33 Q5.3 23.34,15.33 R19.1 R10.2
N$5
  Top 0.406: LED1.1 2.84,11.98 LED2.3
N$6
  Top 0.406: LED0.1 2.7,9.19 LED1.3
N$7  (via drill 0.3)
  Top 0.406: v29.37,17.48 27.34,19.52 24.34,19.52 24.14,19.72 23.43,19.72 23.45,19.69 R11.1 | v31.99,10.04 33.16,10.04 arc-90 33.18,10.02 33.18,10.03 arc-90 SW1.2
  Bottom 0.406: v29.37,17.48 31.52,15.34 31.99,14.87 v31.99,10.04
N$13
  Top 0.406: 24.94,16.88 C4.2 | Q4.1 24.87,17 C4.2 | R19.2 24.08,16.95 24.93,16.95 24.97,16.91 C4.2
N$14
  Top 0.406: 23.45,18.73 R11.2 23.42,18.75 R12.1 21.8,18.75 21.83,18.73 21.83,17.37 Q5.1
N$18
  Top 0.406: R13.2 11.14,20.86 LED.C
N$20  (via drill 0.3)  (1 unrouted)
  Top 0.254: 5.61,8.09 5.61,8.08
  Top 0.406: LED0.3 5.61,8.09 | 5.61,8.08 6.17,8.08 v6.18,8.06 | v12.18,7.4 12.18,8.44 12.63,8.9 14.31,8.9 15.61,10.2 v15.61,15.76 | v12.71,25.92 Q3.3
  Bottom 0.406: v6.18,8.06 8.62,8.06 9.28,7.4 v12.18,7.4 | v15.61,15.76 13.34,15.76 12.71,16.39 v12.71,25.92
N$25
  Top 0.406: Q11.1 10.59,11.03 R8.2 11.99,11.05 R9.1
N$26
  Top 0.406: IC2.1 25.21,8.11 25.21,5.95 25.13,5.95 R1.1 | R1.1
N$31
  Top 0.406: IC2.5 25.25,12.17 25.27,12.17 R7.2
N$33
  Top 0.254: USB-NATIVE.A5 17.8,8.75 R15.1
N$34
  Top 0.254: USB-NATIVE.B5 20.8,8.69 R14.1
RESET  (via drill 0.3)
  Top 0.406: R6.1 29.93,27.36 | 29.93,27.36 29.22,27.36 29.14,27.36 C15.2 29.22,27.38 29.22,27.36 | RST.2 29.74,26.26 v29.74,27.05 29.74,27.17 29.93,27.36
  Bottom 0.406: U5.3 29.72,27.07 v29.74,27.05
SCL_1V8  (via drill 0.3)
  Top 0.406: R4.1 9.67,9.43 Q1.2 8.59,7.55 v8.59,6.66 | U1.6 8.3,2.31 v8.29,2.29
  Bottom 0.406: v8.29,2.29 8.29,6.36 v8.59,6.66
SDA_1V8
  Top 0.406: U1.3 11.4,3.99 R5.1 11.4,6.48 Q2.2
USB_D+  (via drill 0.3)
  Top 0.305: v19.8,13.39 USB-NATIVE.B6 19.8,4.54 19.54,4.27 19.07,4.27 18.8,4.55 USB-NATIVE.A6
  Bottom 0.254: 27.74,13.04 U5.14
  Bottom 0.305: v19.8,13.39 27.5,13.39 U5.14
USB_D-  (via drill 0.3)
  Top 0.305: USB-NATIVE.B7 18.3,7.61 18.91,8.21 | 18.91,8.21 v18.91,14.2 | USB-NATIVE.A7 19.3,7.82 | 19.3,7.82 19.12,8 | 19.12,8 18.91,8.21 | 18.71,7.98 19.1,7.98 | 19.1,7.98 19.1,7.97 | 19.3,7.82 19.12,8 | 19.1,7.98 19.12,8
  Bottom 0.254: U5.13
  Bottom 0.305: v18.91,14.2 27.63,14.2 U5.13
VBAT  (1 unrouted)
  Top 0.61: IC2.3 27.47,7.79 Q15.3 28.18,3.28 28.18,2.98 | 28.18,2.98 C29.1 | BAT.1 28.8,3.61 28.18,2.98 | 27.85,3.62 BAT.1
VBUS  (via drill 0.3)
  Top 0.254: 22.92,9.18 22.92,9.43 | 22.92,9.43 22.97,9.48 22.99,9.5 D11.A | 22.92,9.43 22.97,9.43 23,9.41
  Top 0.406: R20.1 28.76,9.53
  Top 0.61: USB-NATIVE.VBUS1 v16.6,8.23 v16.6,8.24 | USB-NATIVE.VBUS2 21.5,7.76 v21.98,8.24 22.92,9.18 | 22.96,9.41 23,9.41 26.63,9.41 | 26.63,9.41 27.19,9.41 | 27.19,9.41 27.72,9.41 | 28.36,9.41 28.64,9.41 28.76,9.53 28.76,9.81 | IC2.4 27.15,9.45 27.19,9.41 | Q15.1 28.42,7.16 CHG.+ 28.76,8.75 28.1,9.41 | 28.76,9.81 28.76,10.4 C6.2 | 26.63,9.41 27.14,9.91 27.21,9.91 27.72,9.41 | 27.72,9.41 28.1,9.41 | 28.1,9.41 28.36,9.41 | 28.36,9.41 28.76,9.81 | 5.54,11.77 R34.2 5.33,9.19 LED0.4 | 5.54,11.77 5.54,11.95 | 5.54,11.95 5.54,14.39 5.27,14.66 LED2.4 | LED1.4 5.51,11.98 5.54,11.95 | v5.55,10.63 5.55,11.31 5.55,11.54 | 5.55,11.54 5.55,11.77 5.54,11.77 | 5.55,12.66 4.89,12 | 4.89,12 4.86,12 | 4.89,12 5.09,12 5.55,11.54
  Bottom 0.61: v5.55,10.63 7.3,10.63 9.69,8.24 v16.6,8.24 v21.98,8.24
VCC
  Top 0.61: U8.1 C8.2 | C8.2 | C21.2 23.78,21.73 C8.2 | C21.2 25.68,20.76 Q4.3 | U8.3 25.66,21.74 C21.2
VIN_I  (via drill 0.3)
  Top 0.254: 29.47,13.45 29.47,13.44 v30.62,12.29 | SW1.3 33.25,11.14 33.23,11.16
  Top 0.406: 26.67,15.37 26.58,15.37 R10.1 26.59,15.33 26.65,15.33
  Top 0.813: Q15.2 26.5,6.07 v26.5,5.39 | 25.97,13.45 23.61,13.45 23.02,12.86 D11.C | 25.97,13.45 26.65,13.45 | 26.65,13.45 27.34,13.45 | 27.34,13.45 C28.2 29.47,13.45 31.8,11.12 arc-90 31.84,11.16 33.23,11.16 | 26.65,15.33 26.65,14.13 | 26.65,14.13 26.65,13.45 | 26.67,15.37 C4.1 26.67,18.42 Q4.2 | 25.97,13.45 26.65,14.13 | 26.65,14.13 27.34,13.45
  Bottom 0.813: v26.5,5.39 27.36,6.26 27.36,9.03 v30.62,12.29

### Text on the board
tPlace: BOOT | J2 | J1 | SW1 | - | +
bPlace: BUZ | Air Monitor for | Home Assistant V1.0 | - | +